# Altium schematic sheet LLC.SchDoc
size 431 x 279 mm; MPS_ProjectReference: B005; MPS_ProjectName: 230W E-Bike Charger; MPS_Enginieer: Oriol Cos; MPS_Drawn by: -; MPS_Review: v1.2; MPS_SheetNumber: 3; MPS_SheetTotal: 4; MPS_Designed For: Public Reference Design; MPS_Contact: www.monolithicpower.com; Organization: ORGANIZATION; Address1: ADDRESS 1; Address2: ADDRESS 2; Address3: ADDRESS 3; Address4: ADDRESS 4; Revision: -; ENG_APP_DATE: --/--/--; DSN_APP_DATE: --/--/--; CHK_APP_DATE: --/--/--
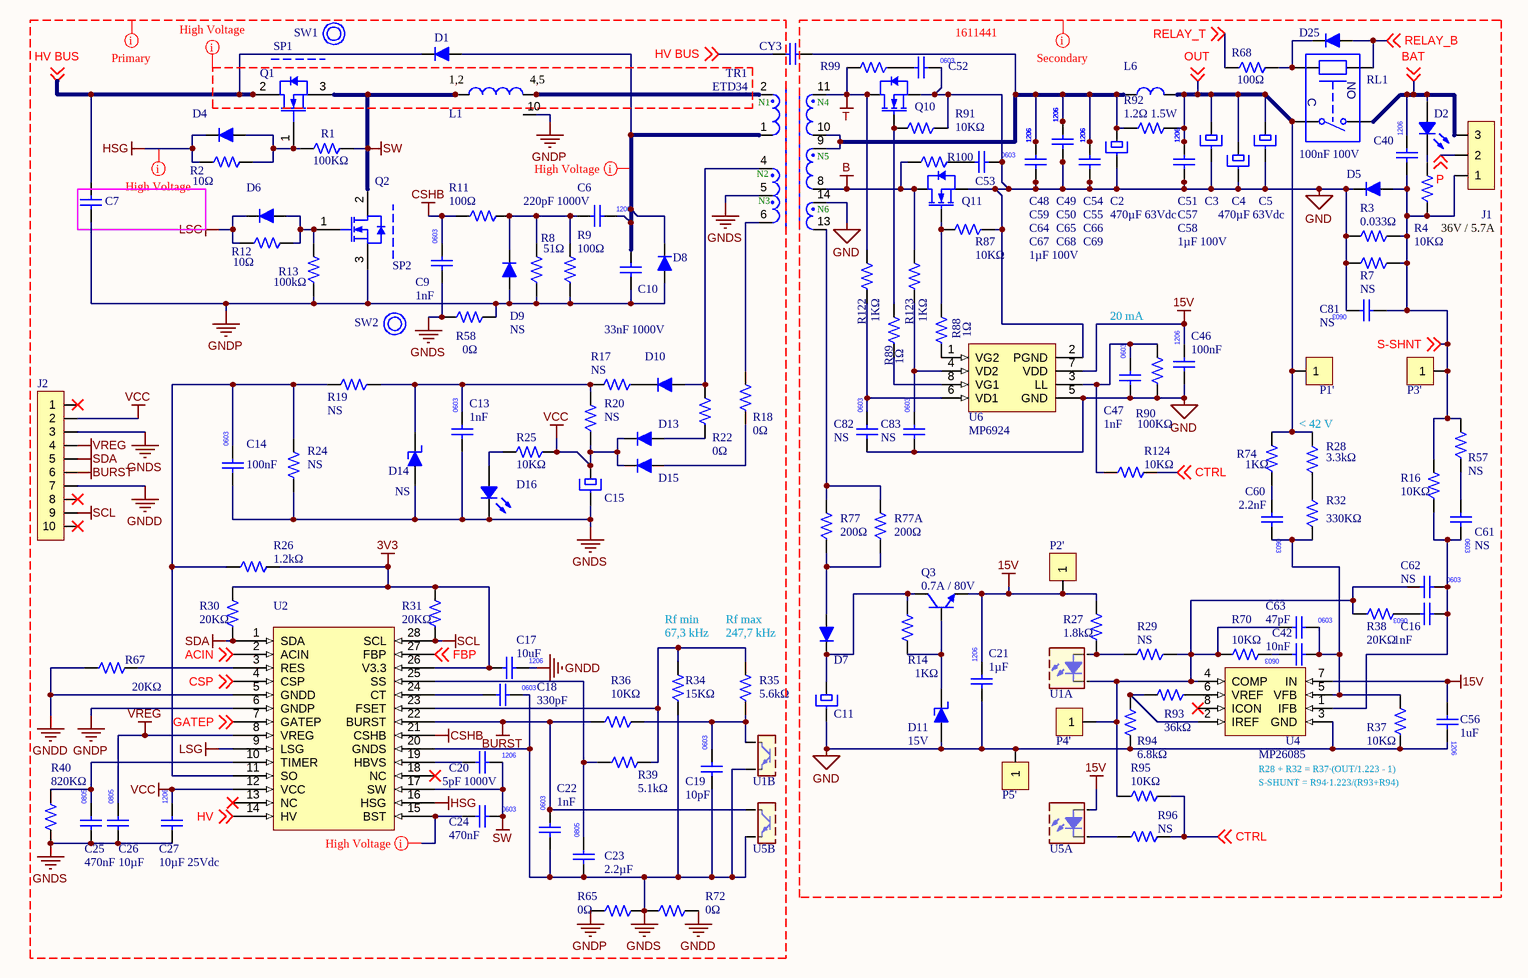
[diagram p0: LLC.SchDoc]

## Parts
C2  value 470µF 63Vdc  [CER13x25]
C3  (no value)  [CER13x25]
C4  (no value)  [CER13x25]
C5  value 470µF 63Vdc  [CER13x25]
C6  value 220pF 1000V  [CC/NM 1206]
C7  (no value)  [POL 11x20x26 r22.5]
C9  value 1nF  [CC/NM 0603]
C10  value 33nF 1000V  [17.5x8.5x15 mm]
C11  (no value)  [CER8x13]
C13  value 1nF  [CC/NM 0603]
C14  value 100nF  [CC/NM 0603]
C15  (no value)  [CER8x13]
C16  value 1nF  [CC/NM 0603]
C17  10uF  [CC/NM 1206]
C18  value 330pF  [CC/NM 0603]
C19  value 10pF  [CC/NM 0603]
C20  value 5pF 1000V  [CC/NM 1206]
C21  value 1µF  [CC/NM 1206]  (hidden comment: Capacitor 1uF)
C22  value 1nF  [CC/NM 0603]
C23  value 2.2µF  [CC/NM 0805]
C24  value 470nF  [CC/NM 0603]
C25  value 470nF  [CC/NM 0805]
C26  value 10µF  [CC/NM 0805]
C27  value 10µF 25Vdc  [CC/NM 1206]
C40  value 100nF 100V  [CC/NM 1206]
C42  value 10nF  [CC/NM 0603]
C46  value 100nF  [CC/NM 1206]
C47  value 1nF  [CC/NM 0603]  (hidden comment: Capacitor 1nF)
C48  value 1µF 100V  [CC/NM 1206]  (hidden comment: Capacitor 1uF)
C49  Capacitor 1uF  [CC/NM 1206]  (value not drawn)
C50  Capacitor 1uF  [CC/NM 1206]  (value not drawn)
C51  Capacitor 1uF  [CC/NM 1206]  (value not drawn)
C52  (no value)  [CC/NM 0603]
C53  (no value)  [CC/NM 0603]
C54  Capacitor 1uF  [CC/NM 1206]  (value not drawn)
C55  Capacitor 1uF  [CC/NM 1206]  (value not drawn)
C56  value 1uF  [CC/NM 1206]  (hidden comment: Capacitor 1uF)
C57  Capacitor 1uF  [CC/NM 1206]  (value not drawn)
C58  value 1µF 100V  [CC/NM 1206]  (hidden comment: Capacitor 1uF)
C59  Capacitor 1uF  [CC/NM 1206]  (value not drawn)
C60  value 2.2nF  [CC/NM 0603]
C61  value NS  [CC/NM 0603]
C62  value NS  [CC/NM 0603]
C63  value 47pF  [CC/NM 0603]
C64  Capacitor 1uF  [CC/NM 1206]  (value not drawn)
C65  Capacitor 1uF  [CC/NM 1206]  (value not drawn)
C66  Capacitor 1uF  [CC/NM 1206]  (value not drawn)
C67  Capacitor 1uF  [CC/NM 1206]  (value not drawn)
C68  Capacitor 1uF  [CC/NM 1206]  (value not drawn)
C69  Capacitor 1uF  [CC/NM 1206]  (value not drawn)
C81  value NS  [CC/NM 0603]  (hidden comment: Capacitor 1nF)
C82  value NS  [CC/NM 0603]  (hidden comment: Capacitor 1nF)
C83  value NS  [CC/NM 0603]  (hidden comment: Capacitor 1nF)
CY3  (no value)  [C_Y_r10mm]
D1  (no value)  [DO-214AC]
D2  (no value)  [LED/0603/GREEN]
D4  (no value)  [SODFL260X90-2N]
D5  (no value)  [DO-214AC]
D6  (no value)  [SODFL260X90-2N]
D7  (no value)  [DO-214AC]
D8  (no value)  [DO-214AC]
D9  NS  [SODFL260X90-2N]
D10  (no value)  [SODFL260X90-2N]
D11  value 15V  [SOT95P237X112-3N]
D13  (no value)  [DO-214AC]
D14  value NS  [SOT95P237X112-3N]
D15  (no value)  [DO-214AC]
D16  (no value)  [LED/0603/GREEN]
D25  (no value)  [SODFL260X90-2N]
J1  MKDSN2,5/3-5.08  [CON 3P DIP]  (value not drawn)
J2  (no value)  [Connector_10p 2.54]
L1  (no value)  [EF20 V]
L6  WE_744732015  [Ind. r5mm]  (value not drawn)
P1'  PIN  [PIN]  (value not drawn)
P2'  PIN  [PIN]  (value not drawn)
P3'  PIN  [PIN]  (value not drawn)
P4'  PIN  [PIN]  (value not drawn)
P5'  PIN  [PIN]  (value not drawn)
Q1  (no value)  [TO-220 Shifted]
Q2  (no value)  [TO-220 Shifted]
Q3  value 0.7A / 80V  [SOT89/4]
Q10  NVMFS6B14NLT1G  [SO-8FL]  (value not drawn)
Q11  NVMFS6B14NLT1G  [SO-8FL]  (value not drawn)
R1  value 100KΩ  [CC/NM 0603]
R2  value 10Ω  [CC/NM 0805]
R3  value 0.033Ω  [CC/NM 2512]
R4  value 10KΩ  [CC/NM 0603]
R7  value NS  [CC/NM 2512]
R8  value 51Ω  [CC/NM 1206]
R9  value 100Ω  [CC/NM 1206]
R11  value 100Ω  [CC/NM 0603]  (hidden comment: Resistor 100)
R12  value 10Ω  [CC/NM 0805]
R13  value 100kΩ  [CC/NM 0603]
R14  value 1KΩ  [CC/NM 0603]
R16  value 10KΩ  [CC/NM 0603]
R17  value NS  [CC/NM 0603]
R18  value 0Ω  [CC/NM 1206]
R19  value NS  [CC/NM 0603]
R20  value NS  [CC/NM 0603]
R22  value 0Ω  [CC/NM 1206]
R24  value NS  [CC/NM 0603]
R25  value 10KΩ  [CC/NM 0603]
R26  value 1.2kΩ  [CC/NM 0603]
R27  value 1.8kΩ  [CC/NM 0603]
R28  value 3.3kΩ  [CC/NM 0603]  (hidden comment: Resistor 3K3)
R29  value NS  [CC/NM 0603]
R30  value 20KΩ  [CC/NM 0603]
R31  value 20KΩ  [CC/NM 0603]
R32  value 330KΩ  [CC/NM 0603]  (hidden comment: Resistor 330K)
R34  value 15KΩ  [CC/NM 0603]
R35  value 5.6kΩ  [CC/NM 0603]
R36  value 10KΩ  [CC/NM 0603]
R37  value 10KΩ  [CC/NM 0603]
R38  value 20KΩ  [CC/NM 0603]
R39  value 5.1kΩ  [CC/NM 0603]
R40  value 820KΩ  [CC/NM 0603]
R57  value NS  [CC/NM 0603]
R58  value 0Ω  [CC/NM 0603]
R65  value 0Ω  [CC/NM 0603]
R67  value 20KΩ  [CC/NM 0603]
R68  value 100Ω  [CC/NM 1206]
R70  value 10KΩ  [CC/NM 0603]
R72  value 0Ω  [CC/NM 0603]
R74  value 1KΩ  [CC/NM 0603]  (hidden comment: Resistor 1K)
R77  value 200Ω  [CC/NM 1206]  (hidden comment: Resistor 0)
R77A  value 200Ω  [CC/NM 1206]  (hidden comment: Resistor 0)
R87  value 10KΩ  [CC/NM 0603]
R88  value 1Ω  [CC/NM 0603]  (hidden comment: Resistor 1)
R89  value 1Ω  [CC/NM 0603]  (hidden comment: Resistor 1)
R90  value 100KΩ  [CC/NM 0603]  (hidden comment: Resistor 100K)
R91  value 10KΩ  [CC/NM 0603]
R92  value 1.2Ω 1.5W  [CC/NM 2512]  (hidden comment: Resistor 1)
R93  value 36kΩ  [CC/NM 0603]  (hidden comment: Resistor 180K)
R94  value 6.8kΩ  [CC/NM 0603]  (hidden comment: Resistor 15K)
R95  value 10KΩ  [CC/NM 0603]
R96  value NS  [CC/NM 0603]
R99  (no value)  [CC/NM 0603]
R100  (no value)  [CC/NM 0603]
R122  value 1KΩ  [CC/NM 0603]  (hidden comment: Resistor 1K)
R123  value 1KΩ  [CC/NM 0603]  (hidden comment: Resistor 1K)
R124  value 10KΩ  [CC/NM 0603]
RL1  (no value)  [Relay 12Vdc / 10A]
SP1  SIL-PAD TO-220  (value not drawn)
SP2  SIL-PAD TO-220  (value not drawn)
SW1  Shoulder Washer M2.5  (value not drawn)
SW2  Shoulder Washer M2.5  (value not drawn)
TR1  ETD34  [ETD34 V]
U1  (no value)  [DIP_SMD]  (parts A,B of 2)
U2  (no value)  [SOIC127P1030X265-28N]
U4  MP26085  [TSOP65P280X100-8N]
U5  (no value)  [DIP_SMD]  (parts A,B of 2)
U6  MP6924  [SOIC8/4.9x3.9x1.8/P1.27/L]

## Nets
3V3: C17.2 R26.2 R30.2 R31.2 U2.26(V3.3)
15V: C21.1 C46.1 C56.2 P2'.1 Q3.2(E) R27.2 U4.7(IN) U5.1 U6.7(VDD)
B: Q11.2(DRAIN) R100.2 R123.2 TR1.8
BURST: C22.1 J2.6 R36.1 U2.22(BURST) U5.4
CSHB: C9.1 R11.1 U2.21(CSHB)
GND: C2.2 C3.2 C4.2 C5.2 C11.2 C21.2 C46.2 C47.2 C48.2 C49.2 C50.2 C51.2 C52.1 C53.1 C54.2 C55.2 C56.1 C57.2 C58.2 C59.2 C64.2 C65.2 C66.2 C67.2 C68.2 C69.2 C81.1 C82.2 C83.2 D5.1 D11.1(A) P5'.1 Q10.3(SOURCE) Q11.3(SOURCE) R3.1 R7.1 R37.1 R87.1 R90.1 R91.1 R94.2 TR1.14 U4.3(GND) U6.2(PGND) U6.5(GND)
GNDD: C17.1 J2.7 R67.1 R72.2 U2.5(GNDD)
GNDP: C7.2 C10.2 D8.2 D9.2 L1.10 Q2.3(SOURCE) R8.1 R9.1 R13.1 R58.2 R65.1 U2.6(GNDP)
GNDS: C9.2 C13.2 C14.2 C15.2 C18.1 C19.2 C22.2 C23.2 C25.2 C26.2 C27.2 D14.1(A) D16.1 J2.3 R24.1 R34.1 R40.2 R58.1 R65.2 R72.1 TR1.5 U1.3 U2.20(GNDS) U5.3
HSG: D4.1 R2.1 U2.16(HSG)
LSG: D6.1 R12.1 U2.9(LSG)
SCL: J2.9 R31.1 U2.28(SCL)
SDA: J2.5 R30.1 U2.1(SDA)
SW: C20.1 C24.1 L1.1 L1.2 Q1.3(SOURCE) Q2.2(DRAIN) R1.1 U2.17(SW)
T: Q10.2(DRAIN) R99.2 R122.2 TR1.11
VCC: C15.1 C27.1 D13.1 D15.1 J2.2 R20.1 R25.1 U2.12(VCC)
VREG: C26.1 J2.4 U2.8(VREG)
ACIN: U2.2(ACIN) ; off-sheet ACIN
BAT: C40.1 D2.2 J1.3 RL1.4 ; off-sheet BAT
CSP: U2.4(CSP) ; off-sheet CSP
CTRL: R95.2 R96.2 R124.2 ; off-sheet CTRL
FBP: U2.27(FBP) ; off-sheet FBP
GATEP: U2.7(GATEP) ; off-sheet GATEP
HV: U2.14(HV) ; off-sheet HV
HV BUS: C7.1 CY3.1 D1.1 Q1.2(DRAIN) ; off-sheet HV BUS
OUT: C3.1 C4.1 C5.1 C51.1 C57.1 C58.1 L6.2 P1'.1 R28.1 R74.2 R92.2 RL1.3 ; off-sheet OUT
P: J1.2 ; off-sheet P
RELAY_B: D25.2 RL1.2 ; off-sheet RELAY_B
RELAY_T: R68.1 ; off-sheet RELAY_T
S-SHNT: C40.2 C81.2 D5.2 J1.1 P3'.1 R3.2 R4.1 R7.2 R16.2 R57.2 ; off-sheet S-SHNT
NetC2_1: C2.1 C48.1 C49.1 C50.1 C54.1 C55.1 C59.1 C64.1 C65.1 C66.1 C67.1 C68.1 C69.1 CY3.2 L6.1 R92.1 TR1.9 TR1.10
NetC6_1: C6.1 C10.1 D1.2 D8.1 TR1.1
NetC6_2: C6.2 D9.1 R8.2 R9.2 R11.2
NetC11_1: C11.1 D7.1 Q3.3(C) R14.1
NetC13_1: C13.1 D14.3(K) R17.2 R19.1 R20.2
NetC14_1: C14.1 R19.2 R24.2 R26.1 U2.11(SO)
NetC16_1: C16.1 R38.2
NetC16_2: C16.2 C61.1 C62.1 R16.1 U4.1(IFB)
NetC18_2: C18.2 U2.24(CT)
NetC19_1: C19.1 R35.1 R36.2 U1.4
NetC20_2: C20.2 U2.19(HBVS)
NetC23_1: C23.1 R39.1 U2.25(SS)
NetC24_2: C24.2 U2.15(BST)
NetC25_1: C25.1 R40.1 U2.10(TIMER)
NetC42_1: C42.1 R70.2
NetC42_2: C42.2 C60.1 C63.1 R32.2 R37.2 U4.5(VFB)
NetC47_1: C47.1 R90.2 R124.1 U6.3(LL)
NetC52_2: C52.2 R99.1
NetC53_2: C53.2 R100.1
NetC60_2: C60.2 R74.1
NetC61_2: C61.2 R57.1
NetC62_2: C62.2 C63.2 P4'.1 R29.1 R38.1 R70.1 R95.1 U1.2 U4.4(COMP)
NetC82_1: C82.1 R122.1 U6.6(VD1)
NetC83_1: C83.1 R123.1 U6.4(VD2)
NetD2_1: D2.1 R4.2
NetD4_2: D4.2 Q1.1(GATE) R1.2 R2.2
NetD6_2: D6.2 Q2.1(GATE) R12.2 R13.2
NetD7_2: D7.2 R77.1 R77A.1
NetD10_1: D10.1 R17.1
NetD10_2: D10.2 R22.2 TR1.4
NetD11_3: D11.3(K) Q3.1(B) R14.2
NetD13_2: D13.2 R22.1
NetD15_2: D15.2 R18.1
NetD16_2: D16.2 R25.2
NetD25_1: D25.1 R68.2 RL1.1
NetL1_4: L1.4 L1.5 TR1.2
NetQ10_1: Q10.1(GATE) R89.2 R91.2
NetQ11_1: Q11.1(GATE) R87.2 R88.2
NetR18_2: R18.2 TR1.6
NetR27_1: R27.1 R29.2 U1.1
NetR28_2: R28.2 R32.1
NetR34_2: R34.2 R35.2 R39.2 U2.23(FSET)
NetR67_2: R67.2 U2.3(RES)
NetR77_2: R77.2 R77A.2 TR1.13
NetR88_1: R88.1 U6.1(VG2)
NetR89_1: R89.1 U6.8(VG1)
NetR93_1: R93.1 U4.6(VREF)
NetR93_2: R93.2 R94.1 U4.2(IREF)
NetR96_1: R96.1 U5.2

Not connected (* = marked no-connect by the designer): J2 1* 8* 10*; U2 13(NC)* 18(NC)*; U4 8(ICON)*

## Layout directives
net class Primary: 3V3, ACIN, BURST, CSHB, CSP, FBP, GATEP, GNDD, GNDP, GNDS, HSG, HV, HV BUS, LSG, SCL, SDA, SW, VCC, VREG
net class Secondary: 15V, B, BAT, CTRL, GND, OUT, P, RELAY_B, RELAY_T, S-SHNT, T
net class HighVoltage: 3V3, ACIN, BURST, CSHB, CSP, FBP, GATEP, GNDD, GNDP, GNDS, HSG, HV, HV BUS, LSG, NetC6_1, NetC24_2, SCL, SDA, SW, VCC, VREG

## Notes on the sheet
- (near C52) 1611441
- (near R4) 36V / 5.7A
- 20 mA
- (near R28) < 42 V
- Rf min
- 67,3 kHz
- Rf max
- 247,7 kHz
- R28 + R32 = R37·(OUT/1.223 - 1)
- S-SHUNT = R94·1.223/(R93+R94)
- DWG. NO.
- REV.
- SHT.
- THIS DOCUMENT AND THE DATA DISCLOSED HEREIN OR HEREWITH IS THE PROPERTY OF ALTIUM LIMITED AND MAY BE FREELY DISTRIBUTED IN WHOLE. NO RIGHTS ARE RESERVED OR EXPRESS OR IMPLIED WARANTEE GIVEN.
- REVISION
- DESCRIPTION
- DATE
- APPROVED
- ENG:
- APPROVALS
- PROJECT
- DSN:
- CHK:
- REFERENCE DOCUMENTS
- PROJECT REVISION:
- TITLE
- DOCUMENT REVISION:
- DESIGN ITEM:
- BOM:
- FAB DWG:
- PCB DWG:
- ASSY DWG:
- SCALE:
- SIZE
- B
- CAGE CODE
- FILE NAME
- DWG NO.
- SHEET
- OF
- REV
- (in symbol Inductance_EF20) 1,2; 4,5
- (in symbol Relay) NO; C
- (in symbol Transformer_ETD34) N1; N4; N5; N2; N3; N6

## Library data of the parts
C2 C5 = Capacitor_Elec_13x25 r5: Manufacturer 1: KEMET; Manufacturer Part Number 1: ESK477M063AL4EA; Package: r5 13x25; Supplier 1: Mouser; Price 1k Ud.: 0.187; Supplier Part Number 1: 80-ESK477M063AL4EA
C3 C4 = Capacitor_Elec_13x25 r5: Manufacturer 1: KEMET; Manufacturer Part Number 1: ESK477M063AL4EA; Value: 470µF 63Vdc; Package: r5 13x25; Supplier 1: Mouser; Price 1k Ud.: 0.187; Supplier Part Number 1: 80-ESK477M063AL4EA
C6 = Capacitor 220pF: 220pF; Manufacturer 1: Murata; Manufacturer Part Number 1: GRM31A7U3A221JW31D; Datasheet: *; Supplier 1: Farnell; Supplier 2: *; Package: 1206; Price 1k Ud.: 0.01; Supplier Part Number 1: 2494281
C7 = Capacitor_26.5x10x18.5 r22.5: Manufacturer 1: KEMET; Manufacturer Part Number 1: R73QN23304030J; Value: 330nF 630Vdc; Package: r22 26x16; Supplier 1: Farnell; Price 1k Ud.: 0.3; Supplier 2: Mouser; Supplier Part Number 1: 2495940; Supplier Part Number 2: 80-R73QN23304030J
C9 = Capacitor 220pF: 1nF; Manufacturer Part Number 1: 0603 1nF; Datasheet: *; Supplier 1: -; Supplier 2: *; Package: 0603; Price 1k Ud.: 0.01; Supplier Part Number 1: -; Manufacturer 1: -
C10 = Capacitor_17.5x8.5x15 r15mm: Manufacturer 1: Kemet; Manufacturer Part Number 1: R60QI2330AAL0K; Datasheet: https://www.mouser.es/datasheet/2/212/KEM_F3103_R60-1103089.pdf; Package: DIP; Supplier 1: Mouser; Price 1k Ud.: 0.2; Supplier Part Number 1: 80-R60QI2330AAL0K
C11 = Capacitor_10x13 r3.8: Manufacturer 1: JIANGHAI; Manufacturer Part Number 1: CD110-35V220; Value: 220µF 35Vdc; Package: r3.5mm; Supplier 1: Farnell; Price 1k Ud.: 0.126; Supplier Part Number 1: 1144707
C13 C22 C47 = Capacitor 1nF: 1nF; Manufacturer Part Number 1: 0603 1nF; Datasheet: *; Supplier 1: -; Supplier 2: *; Package: 0603; Supplier Part Number 1: -; Manufacturer 1: -
  C13 C22: Price 1k Ud.: 0.01
  C47: Voltage: *
C14 = Capacitor 100nF: 100nF; Manufacturer Part Number 1: 0603 100nF; Datasheet: *; Supplier 1: -; Supplier 2: *; Package: 0603; Price 1k Ud.: 0.01; Supplier Part Number 1: -; Manufacturer 1: -
C15 = Capacitor_10x13 r3.8: Manufacturer 1: RUBYCON; Manufacturer Part Number 1: 35ZL220MEFC8X16; Value: 220µF 35Vdc; Package: r3.5 d8; Supplier 1: Farnell; Supplier 2: Mouser; Price 1k Ud.: 0.126; Supplier Part Number 1: 1144707; Supplier Part Number 2: 232-35ZL220MEFC8X16
C16 = Capacitor 22nF: 2.2nF; Manufacturer Part Number 1: 0603 1nF; Datasheet: *; Supplier 1: -; Supplier 2: *; Package: 0603; Price 1k Ud.: 0.01; Supplier Part Number 1: -; Manufacturer 1: -
C17 = Capacitor 10uF: Manufacturer 1: Taiyo Yuden; Manufacturer Part Number 1: EMK316BJ106KD-T; Value: 10µF 16Vdc; Datasheet: *; Supplier 1: Mouser; Supplier 2: *; Package: 1206; Voltage: *; Price 1k Ud.: 0.01; Supplier Part Number 1: 963-EMK316BJ106KD-T
C18 = Capacitor 330pF: 330pF; Manufacturer Part Number 1: 0603 330pF; Datasheet: *; Supplier 1: -; Supplier 2: *; Package: 0603; Price 1k Ud.: 0.01; Supplier Part Number 1: -; Manufacturer 1: -
C19 = Capacitor 10pF: 10pF; Manufacturer Part Number 1: 0603 10pF; Datasheet: *; Supplier 1: -; Supplier 2: *; Package: 0603; Price 1k Ud.: 0.01; Supplier Part Number 1: -; Manufacturer 1: -
C20 = Capacitor 5pF: 5pF; Manufacturer 1: MULTICOMP; Manufacturer Part Number 1: MC1206N4R7C102CT; Datasheet: *; Supplier 1: Farnell; Supplier 2: *; Package: 1206; Price 1k Ud.: 0.01; Supplier Part Number 1: 1855830
C21 C56 = Capacitor 1uF: 1uF; Manufacturer Part Number 1: 1206 1uF; Datasheet: *; Supplier 1: -; Supplier 2: *; Package: 1206; Voltage: *; Price 1k Ud.: 0.01; Supplier Part Number 1: -; Manufacturer 1: -
C23 = Capacitor 2.2uF: 2.2uF; Manufacturer Part Number 1: 0805 2.2uF; Datasheet: *; Supplier 1: -; Supplier 2: *; Package: 0805; Price 1k Ud.: 0.01; Supplier Part Number 1: -; Manufacturer 1: -
C24 = Capacitor 330nF: 470nF; Manufacturer Part Number 1: 0603 470nF; Datasheet: *; Supplier 1: -; Supplier 2: *; Package: 0603; Price 1k Ud.: 0.01; Supplier Part Number 1: -; Manufacturer 1: -
C25 = Capacitor 470nF: 470nF; Manufacturer Part Number 1: 0805 470nF; Datasheet: *; Supplier 1: -; Supplier 2: *; Package: 0805; Price 1k Ud.: 0.01; Supplier Part Number 1: -; Manufacturer 1: -
C26 = Capacitor 10uF: 10uF; Manufacturer Part Number 1: 0805 10uF; Datasheet: *; Supplier 1: -; Supplier 2: *; Package: 0805; Price 1k Ud.: 0.01; Supplier Part Number 1: -; Manufacturer 1: -
C27 = Capacitor 10uF: 10uF; Manufacturer Part Number 1: 1206 10uF 25V; Datasheet: *; Supplier 1: -; Supplier 2: *; Package: 1206; Price 1k Ud.: 0.01; Supplier Part Number 1: -; Manufacturer 1: -
C40 = Capacitor 1nF: 1nF; Manufacturer 1: Vishay; Manufacturer Part Number 1: VJ1206Y104KBBAT4X; Datasheet: https://www.mouser.es/datasheet/2/427/vjomd-223491.pdf; Supplier 1: Mouser; Supplier 2: *; Package: 1206; Price 1k Ud.: 0.01; Supplier Part Number 1: 77-VJ1206Y104KBBAT4X
C42 = Capacitor 22nF: 10nF; Manufacturer Part Number 1: 0603 10nF; Datasheet: *; Supplier 1: -; Supplier 2: *; Package: 0603; Price 1k Ud.: 0.01; Supplier Part Number 1: -; Manufacturer 1: -
C46 = Capacitor 100nF: 100nF; Manufacturer Part Number 1: 1206 100nF; Datasheet: *; Supplier 1: -; Supplier 2: *; Package: 1206; Price 1k Ud.: 0.01; Supplier Part Number 1: -; Manufacturer 1: -
C48 C58 = Capacitor 1uF: 1uF; Manufacturer 1: Murata; Manufacturer Part Number 1: GRM32DC72A475KE01L; Voltage: 100V; Datasheet: https://www.mouser.es/datasheet/2/281/murata_03052018_GRM_Series_1-1310166.pdf; Supplier 1: Mouser; Supplier 2: *; Package: 1206; Price 1k Ud.: 0.01; Supplier Part Number 1: 81-GRM32DC72A475KE1L
C49-C51 C54 C55 C57 C59 C64-C69 = Capacitor 1uF: 1uF; Manufacturer 1: Murata; Manufacturer Part Number 1: GRM32DC72A475KE01L; Value: 1µF 100V; Voltage: 100V; Datasheet: https://www.mouser.es/datasheet/2/281/murata_03052018_GRM_Series_1-1310166.pdf; Supplier 1: Mouser; Supplier 2: *; Package: 1206; Price 1k Ud.: 0.01; Supplier Part Number 1: 81-GRM32DC72A475KE1L
C52 C53 = Capacitor 22nF: 22nF; Manufacturer 1: Kemet; Manufacturer Part Number 1: C0603C470J1GACAUTO; Value: 47pF 100V; Datasheet: *; Supplier 1: Mouser; Supplier 2: *; Package: 0603; Price 1k Ud.: 0.01; Supplier Part Number 1: 80-C0603C470J1GAUTO
C60 = Capacitor 22nF: 22nF; Manufacturer Part Number 1: 0603 2.2nF; Datasheet: *; Supplier 1: -; Supplier 2: *; Package: 0603; Price 1k Ud.: 0.01; Supplier Part Number 1: -; Manufacturer 1: -
C61 C62 = Capacitor 22nF: 22nF; Datasheet: *; Supplier 1: *; Supplier 2: *; Package: 0603; Price 1k Ud.: 0; Manufacturer Part Number 1: NS
C63 = Capacitor 22nF: 22nF; Manufacturer Part Number 1: 0603 47pF; Datasheet: *; Supplier 1: -; Supplier 2: *; Package: 0603; Price 1k Ud.: 0.01; Supplier Part Number 1: -; Manufacturer 1: -
C81-C83 = Capacitor 1nF: 1nF; Datasheet: *; Supplier 1: *; Supplier 2: *; Package: 0603; Voltage: *; Manufacturer Part Number 1: NS
CY3 = Capacitor_Y_r10: Manufacturer 1: Murata; Manufacturer Part Number 1: DE1E3RA222MN4AN01F; Value: 2.2nF CY; Package: r10; Supplier 1: Mouser; Price 1k Ud.: 0; Supplier Part Number 1: 81-DE1E3RA222MN4AN1F
D1 D8 = RS1J: Fast Rectifier 600 V, 1 A, 1.3 V, 250 ns, 30 A; Manufacturer 1: ON SEMICONDUCTOR; Value: 600V 1A; Datasheet: http://www.farnell.com/datasheets/2287956.pdf?_ga=2.70890960.1791824414.1527067450-1671032910.1525848716&_gac=1.117240180.1526460935.Cj0KCQjwre_XBRDVARIsAPf7zZjUOU5-0pyrhwYQ09aPTHihSScNp-g0ngVZM5yZ5xu5MR-Mht2cpfEaAsncEALw_wcB; Supplier 1: Farnell; Supplier 2: *; Package: DO-214AC; Price 1k Ud.: 0.01; Supplier Part Number 1: 2454084; Manufacturer Part Number 1: RS1J
D2 D16 = SML-D12P8WT86C: LED, 0603, Green SMD, 20 mA, 2.2 V, 560 nm; Manufacturer 1: ROHM; Value: Green; Datasheet: http://www.farnell.com/datasheets/2186940.pdf?_ga=2.38369507.1791824414.1527067450-1671032910.1525848716&_gac=1.150161988.1527074352.CjwKCAjwopTYBRAzEiwAnU4kb6z-6FW-YcWql_Nz5Kz7fYgOmlLJCAal4t5nSo58EtdqtK8PVtIzURoCa2gQAvD_BwE; Package: 0603; Supplier 1: Farnell; Price 1k Ud.: 0.01; Supplier Part Number 1: 2687486; Manufacturer Part Number 1: SML-D12P8WT86C
D4 D6 D9 D10 D25 = 1N4148WS: 1N4148  miniMelf Series 500 mW 100 V Max Reverse Voltage 200 mA Small Signal Diode -; Manufacturer 1: ON SEMICONDUCTOR; Value: 75V 150mA; Datasheet: http://www.farnell.com/datasheets/2288055.pdf?_ga=2.37780835.1791824414.1527067450-1671032910.1525848716&_gac=1.116268276.1526460935.Cj0KCQjwre_XBRDVARIsAPf7zZjUOU5-0pyrhwYQ09aPTHihSScNp-g0ngVZM5yZ5xu5MR-Mht2cpfEaAsncEALw_wcB; Supplier 1: Farnell; Supplier 2: *; Package: SOD-323F; Price 1k Ud.: 0.01; Supplier Part Number 1: 2453269; Manufacturer Part Number 1: 1N4148WS
D5 D7 D13 D15 = B160: Manufacturer 1: DIODES; Manufacturer Part Number 1: B160-13-F; Value: 60V 1A; Datasheet: https://www.diodes.com/assets/Datasheets/ds13002.pdf; Package: DO-214AC; Supplier 1: Farnell; Price 1k Ud.: 0.01; Supplier Part Number 1: 1843674
D11 = Zener_18V: Manufacturer 1: ON SEMICONDUCTOR; Manufacturer Part Number 1: BZX84C18LT1G; Datasheet: http://www.farnell.com/datasheets/2236792.pdf?_ga=2.213210964.1976199833.1527489872-1776635558.1522923271&_gac=1.262728446.1526985275.CjwKCAjw_47YBRBxEiwAYuKdww9b6sMrV3bL46mkZpXa3C9ombUFUaiop7L4r4spXLG7BMEaHASa6xoCLfwQAvD_BwE; Package: SOT-23-3; Supplier 1: Farnell; Price 1k Ud.: 0.01; Supplier Part Number 1: 1651579
D14 = Zener_18V: Manufacturer 1: ON SEMICONDUCTOR; Datasheet: http://www.farnell.com/datasheets/2236792.pdf?_ga=2.213210964.1976199833.1527489872-1776635558.1522923271&_gac=1.262728446.1526985275.CjwKCAjw_47YBRBxEiwAYuKdww9b6sMrV3bL46mkZpXa3C9ombUFUaiop7L4r4spXLG7BMEaHASa6xoCLfwQAvD_BwE; Package: SOT-23-3; Supplier 1: Farnell; Price 1k Ud.: 0; Supplier Part Number 1: 1651579; Manufacturer Part Number 1: NS
J1 = MKDSN2,5/3-5.08: CON 3p r5.08; Manufacturer 1: PHOENIX CONTACT; Value: 400A 16A; Datasheet: http://www.farnell.com/datasheets/2325422.pdf?_ga=2.75700885.1877481321.1537857536-1776635558.1522923271; Supplier 1: Farnell; Supplier Part Number 1: 1792767; Manufacturer Part Number 1: MKDSN2,5/3-5.08
J2 = Connector_COM: Manufacturer Part Number 1: NS; Value: 2x5p r2.54; Package: DIP; Price 1k Ud.: 0.01
L1 = Inductance_EF20: Manufacturer 1: PROELEC; Manufacturer Part Number 1: 005-L1; Value: 71µH; Package: EF20; Price 1k Ud.: 2.0
L6 = WE_744732015: Manufacturer 1: WURTH ELEKTRONIK; Value: 1µH 7A; Datasheet: http://www.farnell.com/datasheets/1736053.pdf?_ga=2.153550640.969699499.1536741083-1776635558.1522923271; Supplier 1: Farnell; Supplier Part Number 1: 2211684; Manufacturer Part Number 1: 744732015
P1' P2' P3' P4' P5' = PIN: Manufacturer Part Number 1: NS
Q1 Q2 = IPP60R600C6XKSA1: Transistor MOSFET, Channel N, 7.3 A, 600 V, 0.54 ohm, 10 V, 3 V; Manufacturer 1: Infineon; Manufacturer Part Number 1: IPP65R380E6; Value: 650V 10.5A; Supplier 1: Mouser; Datasheet: http://www.farnell.com/datasheets/1900384.pdf?_ga=2.95452636.1791824414.1527067450-1671032910.1525848716&_gac=1.187305818.1527074352.CjwKCAjwopTYBRAzEiwAnU4kb6z-6FW-YcWql_Nz5Kz7fYgOmlLJCAal4t5nSo58EtdqtK8PVtIzURoCa2gQAvD_BwE; Package: TO-220AC; Price 1k Ud.: 1.04; Supplier Part Number 1: 726-IPP65R380E6
Q3 = BJT_NPN_SOT89: Manufacturer 1: ROHM Semiconductor; Manufacturer Part Number 1: 2SCR514PFRAT100; Supplier 1: Farnell; Price 1k Ud.: 0.01; Supplier Part Number 1: 2576263
Q10 Q11 = NVMFS6B14NLT1G: NMOS 100V 55A 19mR; Manufacturer 1: ON SEMICONDUCTOR; Datasheet: https://www.mouser.es/datasheet/2/308/NVMFS6B14NL-D-931480.pdf; Package: SO-8FL; Supplier 1: Farnell; Value: 100V 55A 19mR; Supplier Part Number 1: 2563382; Manufacturer Part Number 1: NVMFS6B14NLT1G
R1 R13 R90 = Resistor 100K: Resistor 0603; Manufacturer Part Number 1: 0603 100K; Supplier 1: *; Package: 0603; Datasheet: *
  R1 R13: Price 1k Ud.: 0.01
R2 R12 = Resistor 10: Resistor 0805; Manufacturer Part Number 1: 0805 10R; Supplier 1: *; Package: 0805; Datasheet: *; Price 1k Ud.: 0.01
R3 = Resistor 1: Resistor 2512; Manufacturer Part Number 1: 2512; Supplier 1: Farnell; Package: 2512; Datasheet: *; Price 1k Ud.: 0.175; Supplier Part Number 1: 2294089
R4 R16 R25 R36 R37 R70 R87 R91 R95 R124 = Resistor 10K: Resistor 0603; Manufacturer Part Number 1: 0603 10K; Supplier 1: *; Package: 0603; Datasheet: *; Price 1k Ud.: 0.01
R7 = Resistor 1: Resistor 2512; Supplier 1: Farnell; Package: 2512; Datasheet: *; Price 1k Ud.: 0.175; Supplier Part Number 1: 2294089; Manufacturer Part Number 1: NS
R8 = Resistor 51: Resistor 1206; Manufacturer Part Number 1: 1206 51R; Supplier 1: *; Package: 1206; Datasheet: *; Price 1k Ud.: 0.01
R9 R68 = Resistor 100: Resistor 1206; Manufacturer Part Number 1: 1206 100R; Supplier 1: *; Package: 1206; Datasheet: *; Price 1k Ud.: 0.01
R11 = Resistor 100: Resistor 0603; Manufacturer Part Number 1: 0603 100R; Supplier 1: *; Package: 0603; Datasheet: *; Price 1k Ud.: 0.01
R14 R74 R122 R123 = Resistor 1K: Resistor 0603; Manufacturer Part Number 1: 0603 1K; Supplier 1: *; Package: 0603; Datasheet: *
  R14 R74: Price 1k Ud.: 0.01
R17 R19 R20 = Resistor 0: Resistor 0603; Supplier 1: *; Package: 0603; Datasheet: *; Price 1k Ud.: 0; Manufacturer Part Number 1: NS
R18 R22 = Resistor 0: Resistor 1206; Manufacturer Part Number 1: 1206 0R; Supplier 1: *; Package: 1206; Datasheet: *; Price 1k Ud.: 0.01
R24 R57 R96 = Resistor 10K: Resistor 0603; Supplier 1: *; Package: 0603; Datasheet: *; Manufacturer Part Number 1: NS
  R24 R57: Price 1k Ud.: 0
  R96: Price 1k Ud.: 0.01
R26 = Resistor 1K2: Resistor 0603; Manufacturer Part Number 1: 0603 1K2; Supplier 1: *; Package: 0603; Datasheet: *; Price 1k Ud.: 0.01
R27 = Resistor 2K2: Resistor 0603; Manufacturer Part Number 1: 0603 1K8; Supplier 1: *; Package: 0603; Datasheet: *; Price 1k Ud.: 0.01
R28 = Resistor 3K3: Resistor 0603; Manufacturer Part Number 1: 0603 3K3; Supplier 1: *; Package: 0603; Datasheet: *
R29 = Resistor 1K: Resistor 0603; Supplier 1: *; Package: 0603; Datasheet: *; Price 1k Ud.: 0; Manufacturer Part Number 1: NS
R30 R31 R38 R67 = Resistor 20K: Resistor 0603; Manufacturer Part Number 1: 0603 20K; Supplier 1: *; Package: 0603; Datasheet: *; Price 1k Ud.: 0.01
R32 = Resistor 330K: Resistor 0603; Manufacturer Part Number 1: 0603 330K; Supplier 1: *; Package: 0603; Datasheet: *
R34 = Resistor 15K: Resistor 0603; Manufacturer Part Number 1: 0603 15K; Supplier 1: *; Package: 0603; Datasheet: *; Price 1k Ud.: 0.01
R35 = Resistor 5K6: Resistor 0603; Manufacturer Part Number 1: 0603 5K6; Supplier 1: *; Package: 0603; Datasheet: *; Price 1k Ud.: 0.01
R39 = Resistor 5K1: Resistor 0603; Manufacturer Part Number 1: 0603 5K1; Supplier 1: *; Package: 0603; Datasheet: *; Price 1k Ud.: 0.01
R40 = Resistor 820K: Resistor 0603; Manufacturer Part Number 1: 0603 820K; Supplier 1: *; Package: 0603; Datasheet: *; Price 1k Ud.: 0.01
R58 R65 R72 = Resistor 0: Resistor 0603; Manufacturer Part Number 1: 0603; Supplier 1: *; Package: 0603; Datasheet: *; Price 1k Ud.: 0.01
R77 R77A = Resistor 0: Resistor 1206; Manufacturer Part Number 1: 1206 200R; Supplier 1: *; Package: 1206; Datasheet: *; Price 1k Ud.: 0.01
R88 R89 = Resistor 1: Resistor 0603; Manufacturer Part Number 1: 0603 1R; Supplier 1: *; Package: 0603; Datasheet: *
R92 = Resistor 1: Resistor 2512; Manufacturer 1: TE; Manufacturer Part Number 1: 35221R2JT; Supplier 1: Farnell; Package: 2512; Datasheet: *; Price 1k Ud.: 0.10; Supplier Part Number 1: 2476356
R93 = Resistor 180K: Resistor 0603; Manufacturer Part Number 1: 0603 36K; Supplier 1: *; Package: 0603; Datasheet: *
R94 = Resistor 15K: Resistor 0603; Manufacturer Part Number 1: 0603 6K8; Supplier 1: *; Package: 0603; Datasheet: *
R99 R100 = Resistor 10K: Resistor 0603; Manufacturer Part Number 1: 0603 10K; Value: 10KΩ; Supplier 1: *; Package: 0603; Datasheet: *; Price 1k Ud.: 0.01
RL1 = Relay: Manufacturer 1: OEG - TE CONNECTIVITY; Manufacturer Part Number 1: OJE-SS-124HMF,F000; Value: 24Vdc 10A; Datasheet: http://www.farnell.com/datasheets/1846831.pdf?_ga=2.126180429.1976199833.1527489872-1776635558.1522923271&_gac=1.183706452.1526985275.CjwKCAjw_47YBRBxEiwAYuKdww9b6sMrV3bL46mkZpXa3C9ombUFUaiop7L4r4spXLG7BMEaHASa6xoCLfwQAvD_BwE; Package: DIP; Supplier 1: Farnell; Price 1k Ud.: 0.731; Supplier Part Number 1: 1891675
SP1 SP2 = SIL-PAD TO-220: Sil-Pad 2000 es un aislador de conducción térmica de alto rendimiento diseñado para aplicaciones exigentes de tipo militar / aeroespacial y comercial. Sil-Pad 2000 cumple con: MIL-M-38527/8A, MIL-M-38527C y MIL-I-49456. / Fiabilidad y rendimiento óptimos / Aislamiento eléctrico de 4kV (mínimo) / Limpio, sin grasa y flexible / Elastómero de silicona cargado de nitruro de boro / Pre-cortado para transistores, o en lámina no cortada; Manufacturer 1: BERGQUIST; Manufacturer Part Number 1: 2015-54; Value: 3.5W/m.K 4kV; Datasheet: http://www.farnell.com/datasheets/49499.pdf?_ga=2.194756708.870501412.1538985677-1776635558.1522923271; Package: TO-220; Supplier 1: Farnell; Supplier Part Number 1: 681118
SW1 SW2 = Shoulder Washer M2.5: Manufacturer 1: Keystone; Manufacturer Part Number 1: 3103; Value: M2; Datasheet: https://www.mouser.es/datasheet/2/215/103-744481.pdf; Package: M2; Supplier 1: Mouser; Supplier Part Number 1: 534-3103
TR1 = Transformer_ETD34: Manufacturer Part Number 1: 005-TR1; Package: ETD34_V; Value: -
U1 = FOD817A3SD(2): Manufacturer 1: ON SEMICONDUCTOR; Value: 5kV 50mA; Datasheet: http://www.farnell.com/datasheets/2303998.pdf?_ga=2.40932962.1791824414.1527067450-1671032910.1525848716&_gac=1.154130634.1526460935.Cj0KCQjwre_XBRDVARIsAPf7zZjUOU5-0pyrhwYQ09aPTHihSScNp-g0ngVZM5yZ5xu5MR-Mht2cpfEaAsncEALw_wcB; Package: DIP SMD; Supplier 1: Farnell; Price 1k Ud.: 0.01; Supplier Part Number 1: 2322514; Manufacturer Part Number 1: FOD817A3SD
U2 = HR1200: High-Performance / Digital PFC+LLC Combo Controller; Manufacturer 1: MonolithicPowerSystems; Manufacturer Part Number 1: HR1203GY; Datasheet: https://www.monolithicpower.com/pub/media/document/h/r/hr1200_r1.01.pdf; Supplier 1: *; Supplier 2: *; Package: SOIC-28; Price 1k Ud.: 0.5; Value: -
U4 = MP26085: CC/CV Controller; Manufacturer 1: MonolithicPowerSystems; Manufacturer Part Number 1: MP26085DJ; Datasheet: http://www.mouser.com/ds/2/277/MP26085_r1.0-478986.pdf; Supplier 1: *; Supplier 2: *; Package: SOIC-8; Value: -
U5 = FOD817A3SD(2): Manufacturer 1: ON SEMICONDUCTOR; Value: NS; Datasheet: http://www.farnell.com/datasheets/2303998.pdf?_ga=2.40932962.1791824414.1527067450-1671032910.1525848716&_gac=1.154130634.1526460935.Cj0KCQjwre_XBRDVARIsAPf7zZjUOU5-0pyrhwYQ09aPTHihSScNp-g0ngVZM5yZ5xu5MR-Mht2cpfEaAsncEALw_wcB; Package: DIP SMD; Supplier 1: Farnell; Supplier Part Number 1: 2322514; Manufacturer Part Number 1: NS
U6 = MP6924: Manufacturer 1: MonolithicPowerSystems; Manufacturer Part Number 1: MP6924GS-Z; Datasheet: https://media.monolithicpower.com/document/MP6924_1.01.pdf; Package: SOIC-8; Value: -